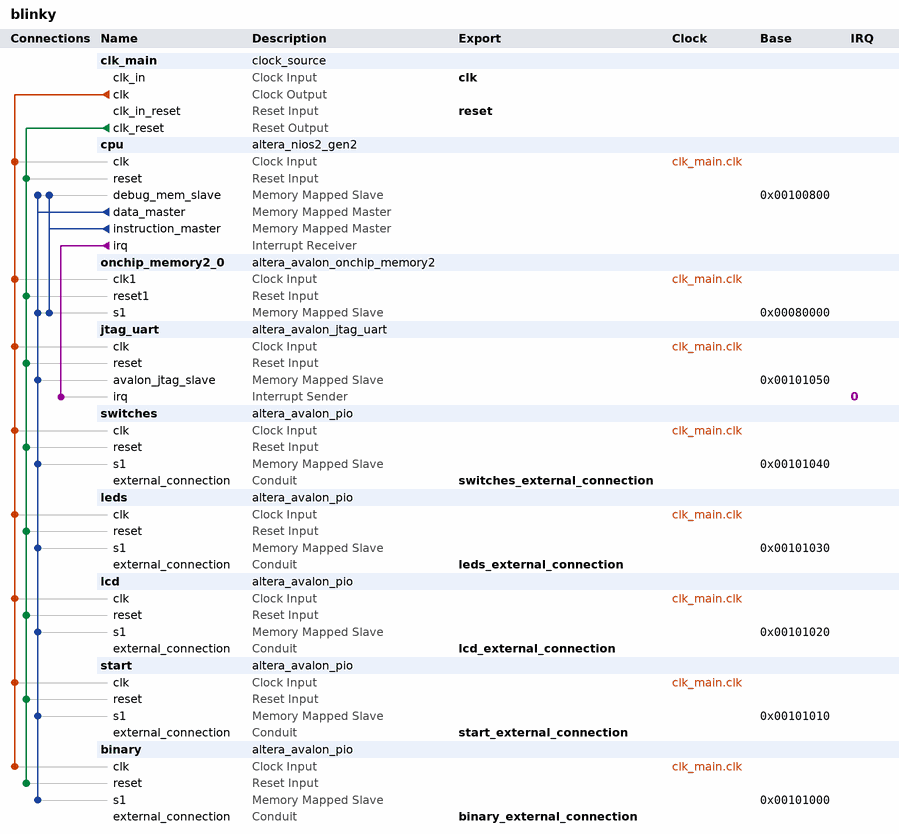
[diagram p0: system contents]
# Platform Designer (Qsys) system blinky, Cyclone IV E EP4CE115F29C7
# Parameters at their usual value, and those the tool derives, are not listed.
package require -exact qsys 18.0
create_system blinky
set_project_property DEVICE_FAMILY {Cyclone IV E}
set_project_property DEVICE EP4CE115F29C7

add_instance clk_main clock_source 18.0
set_instance_parameter_value clk_main clockFrequency 50000000

add_instance cpu altera_nios2_gen2 18.0
set_instance_parameter_value cpu dcache_size 2048
set_instance_parameter_value cpu exceptionSlave onchip_memory2_0.s1
set_instance_parameter_value cpu icache_size 4096
set_instance_parameter_value cpu impl Tiny
set_instance_parameter_value cpu resetSlave onchip_memory2_0.s1

add_instance onchip_memory2_0 altera_avalon_onchip_memory2 18.0
set_instance_parameter_value onchip_memory2_0 dataWidth 32
set_instance_parameter_value onchip_memory2_0 dualPort false
set_instance_parameter_value onchip_memory2_0 initMemContent false
set_instance_parameter_value onchip_memory2_0 initializationFileName onchip_mem.hex
set_instance_parameter_value onchip_memory2_0 memorySize 393216

add_instance jtag_uart altera_avalon_jtag_uart 18.0
set_instance_parameter_value jtag_uart simInteractiveOptions NO_INTERACTIVE_WINDOWS

add_instance switches altera_avalon_pio 18.0
set_instance_parameter_value switches direction Input
set_instance_parameter_value switches width 3

add_instance leds altera_avalon_pio 18.0
set_instance_parameter_value leds direction Output
set_instance_parameter_value leds width 2

add_instance lcd altera_avalon_pio 18.0
set_instance_parameter_value lcd direction Output
set_instance_parameter_value lcd width 12

add_instance start altera_avalon_pio 18.0
set_instance_parameter_value start direction Input
set_instance_parameter_value start width 1

add_instance binary altera_avalon_pio 18.0
set_instance_parameter_value binary direction Input
set_instance_parameter_value binary width 2

# connections
add_connection clk_main.clk binary.clk clock
add_connection clk_main.clk cpu.clk clock
add_connection clk_main.clk jtag_uart.clk clock
add_connection clk_main.clk lcd.clk clock
add_connection clk_main.clk leds.clk clock
add_connection clk_main.clk onchip_memory2_0.clk1 clock
add_connection clk_main.clk start.clk clock
add_connection clk_main.clk switches.clk clock
add_connection clk_main.clk_reset binary.reset reset
add_connection clk_main.clk_reset cpu.reset reset
add_connection clk_main.clk_reset jtag_uart.reset reset
add_connection clk_main.clk_reset lcd.reset reset
add_connection clk_main.clk_reset leds.reset reset
add_connection clk_main.clk_reset onchip_memory2_0.reset1 reset
add_connection clk_main.clk_reset start.reset reset
add_connection clk_main.clk_reset switches.reset reset
add_connection cpu.data_master binary.s1 avalon
set_connection_parameter_value cpu.data_master/binary.s1 baseAddress 0x00101000
add_connection cpu.data_master cpu.debug_mem_slave avalon
set_connection_parameter_value cpu.data_master/cpu.debug_mem_slave baseAddress 0x00100800
add_connection cpu.data_master jtag_uart.avalon_jtag_slave avalon
set_connection_parameter_value cpu.data_master/jtag_uart.avalon_jtag_slave baseAddress 0x00101050
add_connection cpu.data_master lcd.s1 avalon
set_connection_parameter_value cpu.data_master/lcd.s1 baseAddress 0x00101020
add_connection cpu.data_master leds.s1 avalon
set_connection_parameter_value cpu.data_master/leds.s1 baseAddress 0x00101030
add_connection cpu.data_master onchip_memory2_0.s1 avalon
set_connection_parameter_value cpu.data_master/onchip_memory2_0.s1 baseAddress 0x00080000
add_connection cpu.data_master start.s1 avalon
set_connection_parameter_value cpu.data_master/start.s1 baseAddress 0x00101010
add_connection cpu.data_master switches.s1 avalon
set_connection_parameter_value cpu.data_master/switches.s1 baseAddress 0x00101040
add_connection cpu.instruction_master cpu.debug_mem_slave avalon
set_connection_parameter_value cpu.instruction_master/cpu.debug_mem_slave baseAddress 0x00100800
add_connection cpu.instruction_master onchip_memory2_0.s1 avalon
set_connection_parameter_value cpu.instruction_master/onchip_memory2_0.s1 baseAddress 0x00080000
add_connection cpu.irq jtag_uart.irq interrupt
set_connection_parameter_value cpu.irq/jtag_uart.irq irqNumber 0

# exported interfaces
add_interface binary_external_connection conduit end
set_interface_property binary_external_connection EXPORT_OF binary.external_connection
add_interface clk clock sink
set_interface_property clk EXPORT_OF clk_main.clk_in
add_interface lcd_external_connection conduit end
set_interface_property lcd_external_connection EXPORT_OF lcd.external_connection
add_interface leds_external_connection conduit end
set_interface_property leds_external_connection EXPORT_OF leds.external_connection
add_interface reset reset sink
set_interface_property reset EXPORT_OF clk_main.clk_in_reset
add_interface start_external_connection conduit end
set_interface_property start_external_connection EXPORT_OF start.external_connection
add_interface switches_external_connection conduit end
set_interface_property switches_external_connection EXPORT_OF switches.external_connection

set_interconnect_requirement {$system} qsys_mm.clockCrossingAdapter HANDSHAKE
set_interconnect_requirement {$system} qsys_mm.enableEccProtection FALSE
set_interconnect_requirement {$system} qsys_mm.insertDefaultSlave FALSE
set_interconnect_requirement {$system} qsys_mm.maxAdditionalLatency 1

save_system blinky.qsys
